# EAGLE design Super-Regenerative-VHF-KosmosX3000 (EAGLE 7.2.0)
Kosmos X3000 FM Super Regen http://www.edaboard.com/thread140764-4.html#post1374216
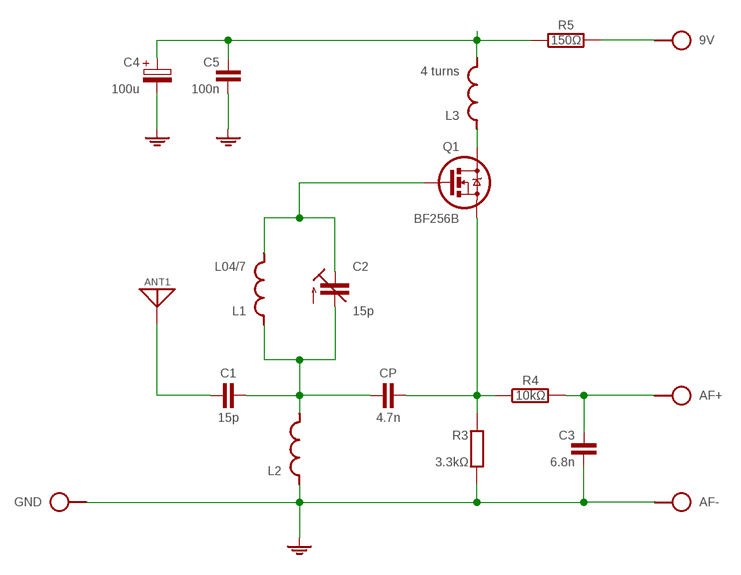
[diagram p0: schematic, sheet 1]

## Parts
9V  SPAD  [SPAD@1]
AF+  SPAD  [SPAD@1]
AF-  SPAD  [SPAD@1]
ANT1  ANT  [SPAD]
C1  15p  C025-015X024  [C025-015X024]
C2  15p  C-TR-PH201272222-808-2PINB  [TRIM-2222-808]
C3  6.8n  C050-020X036  [C050-020X036]
C4  100u  CPOLE2,5-4/V  [E2.5-4/V]
C5  100n  C025-015X024  [C025-015X024]
CP  4.7n  C050-020X036/V  [C050-020X036/V]
GND  SPAD  [SPAD@1]
L1  L04/7  L-SHORT04-5/5V-C  [L-04-5/6V-C]
L2  L-SHORT03/10  [L-03/10]
L3  4 turns  L-SHORT04-5/5V-C  [L-04-5/6V-C]
Q1  BF256B  [TO92]
R3  3.3kΩ  R0204/10  [0204/10]
R4  10kΩ  R-H0202/10  [0202/10]
R5  150Ω  R-H0202/10  [0202/10]

## Nets
GND: AF-.1 C3.2 C4.- C5.2 GND.1 L2.2 R3.2
N$1: CP.1 Q1.2(S) R3.1 R4.1
N$2: AF+.1 C3.1 R4.2
N$3: ANT1.1 C1.2
N$4: C4.+ C5.1 L3.1 R5.1
N$5: C2.3(E) L1.1 Q1.1(G)
N$6: C1.1 C2.2(A) CP.2 L1.2 L2.1
N$7: L3.2 Q1.3(D)
N$8: 9V.1 R5.2

## Library data of the parts
9V AF+ AF- GND = pad:SPAD
ANT1 = pad:ANT
C1 C3 C5 CP = c:C: CAPACITOR, European symbol
C2 = cap-trim:C-TR-PH20127
C4 = c:CPOL: POLARIZED CAPACITOR, European symbol
L1-L3 = l:L-SHORT
Q1 = t:BF256B
R3 = r:R: RESISTOR, European symbol
R4 R5 = r:R-H

## Net classes
0 default: width 0.61 mm

## Board
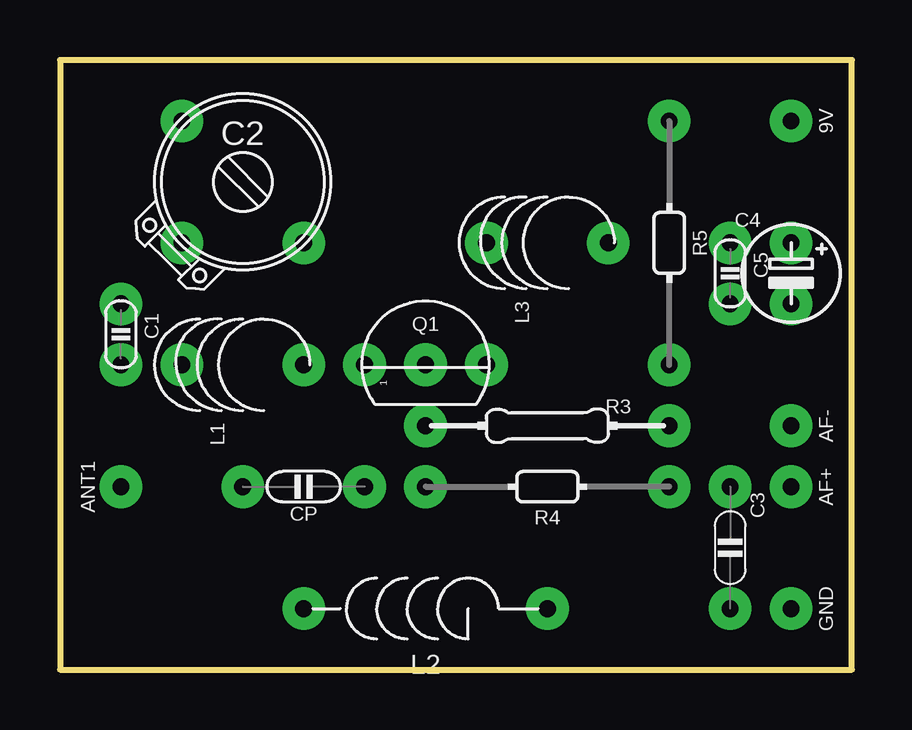
[diagram p1: board, top side]
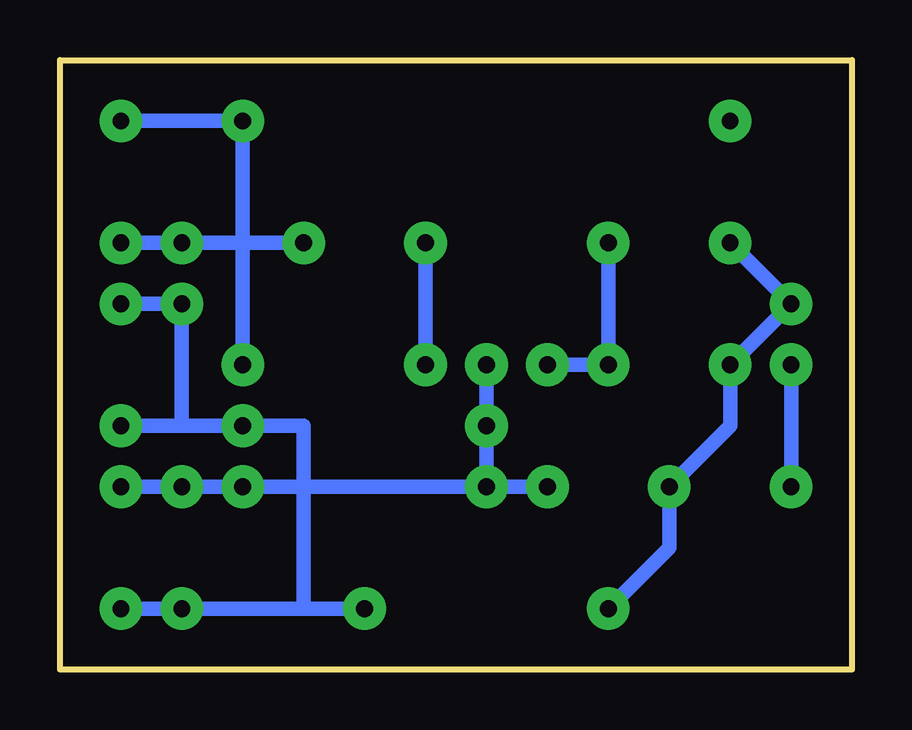
[diagram p2: board, bottom side, seen from below]

Size 33.02 x 25.4 mm. Coordinates in mm from the lower left corner, seen from the top.
Outline: 0,0 33.02,0 33.02,25.4 0,25.4 0,0
Copper layers (1*16): Top 0.035mm / dielectric 1.5mm / Bottom 0.035mm
Design rules "default": minimum track width 10mil, minimum drill 24mil, track to track 8mil, track to pad 8mil, pad to pad 8mil, via to via 8mil, smd to smd 8mil, copper to edge 40mil, drill to drill 8mil, minimum pad ring 10mil, minimum via ring 8mil, stop-mask expansion 4mil, vias tented up to drill 0mil, thermal gap 10mil

### Footprints (pad centres in the part's own frame; a part is rotated, then mirrored left to right if it is on the bottom)
SPAD@1 = drill 0.7 pad 1.778: 1 0,0
SPAD = drill 0.7 pad 1.778: 1 0,0
C025-015X024 = drill 0.7 pad 1.778: 1 -1.27,0; 2 1.27,0
TRIM-2222-808 = drill 0.7 pad 1.778: 1 -2.54,2.54; 2 -2.54,-2.54; 3 2.54,-2.54
C050-020X036 = drill 0.7 pad 1.778: 1 -2.54,0; 2 2.54,0
E2.5-4/V = drill 0.7 pad 1.778: + 0,1.27; - 0,-1.27
C050-020X036/V = drill 0.7 pad 1.778: 1 0,-2.54; 2 0,2.54
L-04-5/6V-C = drill 0.7 pad 1.778: 1 0,-2.54; 2 0,2.54
L-03/10 = drill 0.7 pad 1.778: 1 5.08,0; 2 -5.08,0
TO92 = drill 0.7 pad 1.778: 1 0,2.54; 2 0,0; 3 0,-2.54
0204/10 = drill 0.7 pad 1.778: 1 -5.08,0; 2 5.08,0
0202/10 = drill 0.7 pad 1.778: 1 -5.08,0; 2 5.08,0

### Placement (x,y rotation side)
9V  30.48,22.86 180 top
AF+  30.48,7.62 180 top
AF-  30.48,10.16 180 top
ANT1  2.54,7.62 0 top
C1  2.54,13.97 270 top
C2  7.62,20.32 0 top
C3  27.94,5.08 270 top
C4  30.48,16.51 0 top
C5  27.94,16.51 270 top
CP  10.16,7.62 90 top
GND  30.48,2.54 180 top
L1  7.62,12.7 90 top
L2  15.24,2.54 180 top
L3  20.32,17.78 90 top
Q1  15.24,12.7 90 top
R3  20.32,10.16 0 top
R4  20.32,7.62 180 top
R5  25.4,17.78 270 top

### Tracks (layer width: path | path; a pad name or v marks a point on that pad's centre or on a via)
GND
  Bottom 0.61: C3.2 22.86,2.54 | 22.86,2.54 L2.2 | L2.2 | C3.2 | C3.2 GND.1 | GND.1 | C3.2 | C4.- C5.2 | C5.2 | C4.- | AF-.1 27.94,10.16 | 27.94,10.16 R3.2 | 27.94,10.16 C5.2 | C5.2 | 22.86,2.54 22.86,10.16 R3.2 | R3.2
N$1
  Bottom 0.61: 15.24,7.62 CP.1 | CP.1 | 15.24,7.62 R4.1 15.24,7.62 | Q1.2 R3.1 | Q1.2 | R3.1 15.24,7.62 | R3.1
N$2
  Bottom 0.61: C3.1 25.4,7.62 R4.2 | C3.1 | C3.1 AF+.1 | AF+.1 | C3.1
N$3
  Bottom 0.61: C1.2 ANT1.1 | ANT1.1 | C1.2
N$4
  Bottom 0.61: C5.1 C4.+ | C4.+ | C5.1 | C5.1 25.4,17.78 | 25.4,17.78 L3.1 | L3.1 | C5.1 | 25.4,17.78 25.4,12.7 R5.1
N$5
  Bottom 0.61: L1.1 C2.3 | L1.1 Q1.1 | Q1.1 | L1.1
N$6
  Bottom 0.61: C1.1 C2.2 | C2.2 | C1.1 | C1.1 L1.2 | L1.2 | C1.1 | CP.2 7.62,5.08 L2.1 | CP.2 | L2.1 | L1.2 5.08,10.16 CP.2 | L1.2 | CP.2
N$7
  Bottom 0.61: L3.2 Q1.3 | Q1.3 | L3.2
N$8
  Bottom 0.61: 9V.1 25.4,22.86 R5.2 | 9V.1